# Altium schematic sheet 452006257#BDU控制板7-执行部件.SchDoc
size A3; SheetNumber: 12; SheetTotal: 11
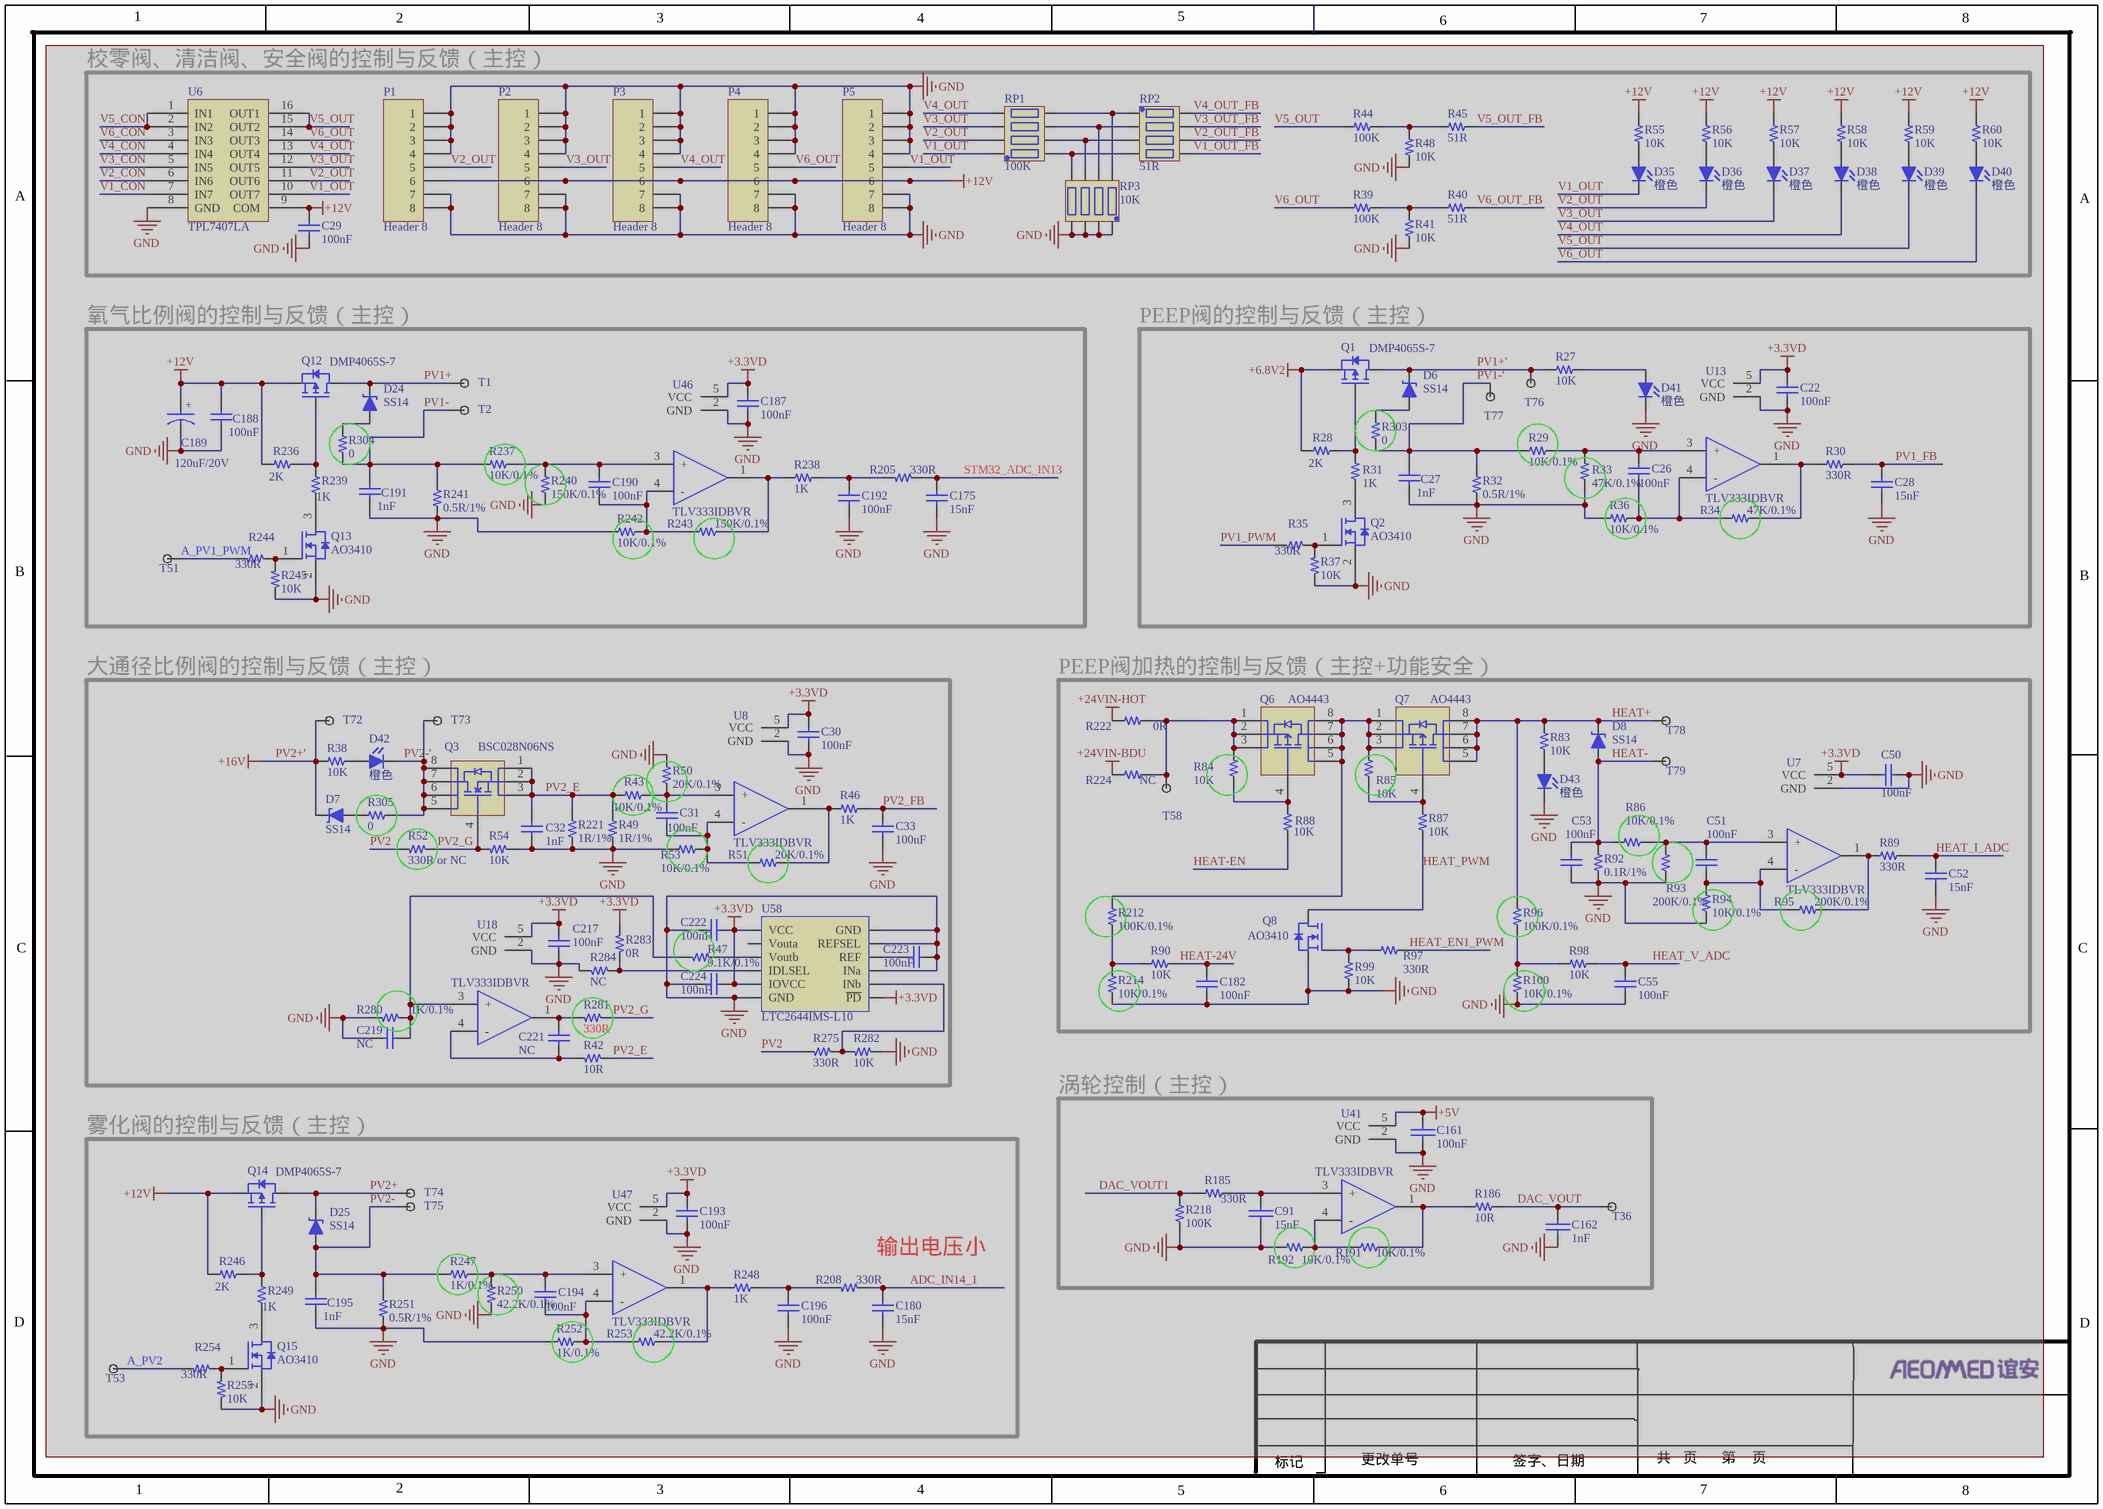
[diagram p0: 452006257#BDU控制板7-执行部件.SchDoc]

## Parts
C22  100nF  [C-0603]  (masked out: inside a compile mask, not in the netlist)
C26  100nF  [C-0603]  (masked out: inside a compile mask, not in the netlist)
C27  1nF  [C-0603]  (masked out: inside a compile mask, not in the netlist)
C28  15nF  [C-0603]  (masked out: inside a compile mask, not in the netlist)
C29  100nF  [C-0603]  (masked out: inside a compile mask, not in the netlist)
C30  100nF  [C-0603]  (masked out: inside a compile mask, not in the netlist)
C31  100nF  [C-0603]  (masked out: inside a compile mask, not in the netlist)
C32  1nF  [C-0603]  (masked out: inside a compile mask, not in the netlist)
C33  100nF  [C-0603]  (masked out: inside a compile mask, not in the netlist)
C50  100nF  [C-0603]  (masked out: inside a compile mask, not in the netlist)
C51  100nF  [C-0603]  (masked out: inside a compile mask, not in the netlist)
C52  15nF  [C-0603]  (masked out: inside a compile mask, not in the netlist)
C53  100nF  [C-0603]  (masked out: inside a compile mask, not in the netlist)
C55  100nF  [C-0603]  (masked out: inside a compile mask, not in the netlist)
C91  15nF  [C-0603]  (masked out: inside a compile mask, not in the netlist)
C161  100nF  [C-0603]  (masked out: inside a compile mask, not in the netlist)
C162  1nF  [C-0603]  (masked out: inside a compile mask, not in the netlist)
C175  15nF  [C-0603]  (masked out: inside a compile mask, not in the netlist)
C180  15nF  [C-0603]  (masked out: inside a compile mask, not in the netlist)
C182  100nF  [C-0603]  (masked out: inside a compile mask, not in the netlist)
C187  100nF  [C-0603]  (masked out: inside a compile mask, not in the netlist)
C188  100nF  [C-0603]  (masked out: inside a compile mask, not in the netlist)
C189  120uF/20V  [CAP-SMD-φ6.3]  (masked out: inside a compile mask, not in the netlist)
C190  100nF  [C-0603]  (masked out: inside a compile mask, not in the netlist)
C191  1nF  [C-0603]  (masked out: inside a compile mask, not in the netlist)
C192  100nF  [C-0603]  (masked out: inside a compile mask, not in the netlist)
C193  100nF  [C-0603]  (masked out: inside a compile mask, not in the netlist)
C194  100nF  [C-0603]  (masked out: inside a compile mask, not in the netlist)
C195  1nF  [C-0603]  (masked out: inside a compile mask, not in the netlist)
C196  100nF  [C-0603]  (masked out: inside a compile mask, not in the netlist)
C217  100nF  [C-0603]  (masked out: inside a compile mask, not in the netlist)
C219  NC  [C-0603]  (masked out: inside a compile mask, not in the netlist)
C221  NC  [C-0603]  (masked out: inside a compile mask, not in the netlist)
C222  100nF  [C-0603]  (masked out: inside a compile mask, not in the netlist)
C223  100nF  [C-0603]  (masked out: inside a compile mask, not in the netlist)
C224  100nF  [C-0603]  (masked out: inside a compile mask, not in the netlist)
D6  SS14  [DO-214AC/SMA]  (masked out: inside a compile mask, not in the netlist)
D7  SS14  [DO-214AC/SMA]  (masked out: inside a compile mask, not in the netlist)
D8  SS14  [DO-214AC/SMA]  (masked out: inside a compile mask, not in the netlist)
D24  SS14  [DO-214AC/SMA]  (masked out: inside a compile mask, not in the netlist)
D25  SS14  [DO-214AC/SMA]  (masked out: inside a compile mask, not in the netlist)
D35  橙色  [LED-0805]  (masked out: inside a compile mask, not in the netlist)
D36  橙色  [LED-0805]  (masked out: inside a compile mask, not in the netlist)
D37  橙色  [LED-0805]  (masked out: inside a compile mask, not in the netlist)
D38  橙色  [LED-0805]  (masked out: inside a compile mask, not in the netlist)
D39  橙色  [LED-0805]  (masked out: inside a compile mask, not in the netlist)
D40  橙色  [LED-0805]  (masked out: inside a compile mask, not in the netlist)
D41  橙色  [LED-0805]  (masked out: inside a compile mask, not in the netlist)
D42  橙色  [LED-0805]  (masked out: inside a compile mask, not in the netlist)
D43  橙色  [LED-0805]  (masked out: inside a compile mask, not in the netlist)
P1  Header 8  [K8X1C-705-K32-OX1]  (masked out: inside a compile mask, not in the netlist)
P2  Header 8  [K8X1C-705-K32-OX1]  (masked out: inside a compile mask, not in the netlist)
P3  Header 8  [K8X1C-705-K32-OX1]  (masked out: inside a compile mask, not in the netlist)
P4  Header 8  [K8X1C-705-K32-OX1]  (masked out: inside a compile mask, not in the netlist)
P5  Header 8  [K8X1C-705-K32-OX1]  (masked out: inside a compile mask, not in the netlist)
Q1  DMP4065S-7  [SOT23-3]  (masked out: inside a compile mask, not in the netlist)
Q2  AO3410  [SOT23-3]  (masked out: inside a compile mask, not in the netlist)
Q3  BSC028N06NS  [PG-TDSON-8]  (masked out: inside a compile mask, not in the netlist)
Q6  AO4443  [SOIC8]  (masked out: inside a compile mask, not in the netlist)
Q7  AO4443  [SOIC8]  (masked out: inside a compile mask, not in the netlist)
Q8  AO3410  [SOT23-3]  (masked out: inside a compile mask, not in the netlist)
Q12  DMP4065S-7  [SOT23-3]  (masked out: inside a compile mask, not in the netlist)
Q13  AO3410  [SOT23-3]  (masked out: inside a compile mask, not in the netlist)
Q14  DMP4065S-7  [SOT23-3]  (masked out: inside a compile mask, not in the netlist)
Q15  AO3410  [SOT23-3]  (masked out: inside a compile mask, not in the netlist)
R27  10K  [R-0603]  (masked out: inside a compile mask, not in the netlist)
R28  2K  [R-0603]  (masked out: inside a compile mask, not in the netlist)
R29  10K/0.1%  [R-0603]  (masked out: inside a compile mask, not in the netlist)
R30  330R  [R-0603]  (masked out: inside a compile mask, not in the netlist)
R31  1K  [R-0603]  (masked out: inside a compile mask, not in the netlist)
R32  0.5R/1%  [R-2010]  (masked out: inside a compile mask, not in the netlist)
R33  47K/0.1%  [R-0603]  (masked out: inside a compile mask, not in the netlist)
R34  47K/0.1%  [R-0603]  (masked out: inside a compile mask, not in the netlist)
R35  330R  [R-0603]  (masked out: inside a compile mask, not in the netlist)
R36  10K/0.1%  [R-0603]  (masked out: inside a compile mask, not in the netlist)
R37  10K  [R-0603]  (masked out: inside a compile mask, not in the netlist)
R38  10K  [R-0603]  (masked out: inside a compile mask, not in the netlist)
R39  100K  [R-0603]  (masked out: inside a compile mask, not in the netlist)
R40  51R  [R-0603]  (masked out: inside a compile mask, not in the netlist)
R41  10K  [R-0603]  (masked out: inside a compile mask, not in the netlist)
R42  10R  [R-0603]  (masked out: inside a compile mask, not in the netlist)
R43  10K/0.1%  [R-0603]  (masked out: inside a compile mask, not in the netlist)
R44  100K  [R-0603]  (masked out: inside a compile mask, not in the netlist)
R45  51R  [R-0603]  (masked out: inside a compile mask, not in the netlist)
R46  1K  [R-0603]  (masked out: inside a compile mask, not in the netlist)
R47  9.1K/0.1%  [R-0603]  (masked out: inside a compile mask, not in the netlist)
R48  10K  [R-0603]  (masked out: inside a compile mask, not in the netlist)
R49  1R/1%  [R-2010]  (masked out: inside a compile mask, not in the netlist)
R50  20K/0.1%  [R-0603]  (masked out: inside a compile mask, not in the netlist)
R51  20K/0.1%  [R-0603]  (masked out: inside a compile mask, not in the netlist)
R52  330R or NC  [R-0603]  (masked out: inside a compile mask, not in the netlist)
R53  10K/0.1%  [R-0603]  (masked out: inside a compile mask, not in the netlist)
R54  10K  [R-0603]  (masked out: inside a compile mask, not in the netlist)
R55  10K  [R-0603]  (masked out: inside a compile mask, not in the netlist)
R56  10K  [R-0603]  (masked out: inside a compile mask, not in the netlist)
R57  10K  [R-0603]  (masked out: inside a compile mask, not in the netlist)
R58  10K  [R-0603]  (masked out: inside a compile mask, not in the netlist)
R59  10K  [R-0603]  (masked out: inside a compile mask, not in the netlist)
R60  10K  [R-0603]  (masked out: inside a compile mask, not in the netlist)
R83  10K  [R-0603]  (masked out: inside a compile mask, not in the netlist)
R84  10K  [R-0603]  (masked out: inside a compile mask, not in the netlist)
R85  10K  [R-0603]  (masked out: inside a compile mask, not in the netlist)
R86  10K/0.1%  [R-0603]  (masked out: inside a compile mask, not in the netlist)
R87  10K  [R-0603]  (masked out: inside a compile mask, not in the netlist)
R88  10K  [R-0603]  (masked out: inside a compile mask, not in the netlist)
R89  330R  [R-0603]  (masked out: inside a compile mask, not in the netlist)
R90  10K  [R-0603]  (masked out: inside a compile mask, not in the netlist)
R92  0.1R/1%  [R-2010]  (masked out: inside a compile mask, not in the netlist)
R93  200K/0.1%  [R-0603]  (masked out: inside a compile mask, not in the netlist)
R94  10K/0.1%  [R-0603]  (masked out: inside a compile mask, not in the netlist)
R95  200K/0.1%  [R-0603]  (masked out: inside a compile mask, not in the netlist)
R96  100K/0.1%  [R-0603]  (masked out: inside a compile mask, not in the netlist)
R97  330R  [R-0603]  (masked out: inside a compile mask, not in the netlist)
R98  10K  [R-0603]  (masked out: inside a compile mask, not in the netlist)
R99  10K  [R-0603]  (masked out: inside a compile mask, not in the netlist)
R100  10K/0.1%  [R-0603]  (masked out: inside a compile mask, not in the netlist)
R185  330R  [R-0603]  (masked out: inside a compile mask, not in the netlist)
R186  10R  [R-0603]  (masked out: inside a compile mask, not in the netlist)
R191  10K/0.1%  [R-0603]  (masked out: inside a compile mask, not in the netlist)
R192  10K/0.1%  [R-0603]  (masked out: inside a compile mask, not in the netlist)
R205  330R  [R-0603]  (masked out: inside a compile mask, not in the netlist)
R208  330R  [R-0603]  (masked out: inside a compile mask, not in the netlist)
R212  100K/0.1%  [R-0603]  (masked out: inside a compile mask, not in the netlist)
R214  10K/0.1%  [R-0603]  (masked out: inside a compile mask, not in the netlist)
R218  100K  [R-0603]  (masked out: inside a compile mask, not in the netlist)
R221  1R/1%  [R-2010]  (masked out: inside a compile mask, not in the netlist)
R222  0R  [R-1206]  (masked out: inside a compile mask, not in the netlist)
R224  NC  [R-1206]  (masked out: inside a compile mask, not in the netlist)
R236  2K  [R-0603]  (masked out: inside a compile mask, not in the netlist)
R237  10K/0.1%  [R-0603]  (masked out: inside a compile mask, not in the netlist)
R238  1K  [R-0603]  (masked out: inside a compile mask, not in the netlist)
R239  1K  [R-0603]  (masked out: inside a compile mask, not in the netlist)
R240  150K/0.1%  [R-0603]  (masked out: inside a compile mask, not in the netlist)
R241  0.5R/1%  [R-2010]  (masked out: inside a compile mask, not in the netlist)
R242  10K/0.1%  [R-0603]  (masked out: inside a compile mask, not in the netlist)
R243  150K/0.1%  [R-0603]  (masked out: inside a compile mask, not in the netlist)
R244  330R  [R-0603]  (masked out: inside a compile mask, not in the netlist)
R245  10K  [R-0603]  (masked out: inside a compile mask, not in the netlist)
R246  2K  [R-0603]  (masked out: inside a compile mask, not in the netlist)
R247  1K/0.1%  [R-0603]  (masked out: inside a compile mask, not in the netlist)
R248  1K  [R-0603]  (masked out: inside a compile mask, not in the netlist)
R249  1K  [R-0603]  (masked out: inside a compile mask, not in the netlist)
R250  42.2K/0.1%  [R-0603]  (masked out: inside a compile mask, not in the netlist)
R251  0.5R/1%  [R-2010]  (masked out: inside a compile mask, not in the netlist)
R252  1K/0.1%  [R-0603]  (masked out: inside a compile mask, not in the netlist)
R253  42.2K/0.1%  [R-0603]  (masked out: inside a compile mask, not in the netlist)
R254  330R  [R-0603]  (masked out: inside a compile mask, not in the netlist)
R255  10K  [R-0603]  (masked out: inside a compile mask, not in the netlist)
R275  330R  [R-0603]  (masked out: inside a compile mask, not in the netlist)
R280  1K/0.1%  [R-0603]  (masked out: inside a compile mask, not in the netlist)
R281  330R  [R-0603]  (masked out: inside a compile mask, not in the netlist)
R282  10K  [R-0603]  (masked out: inside a compile mask, not in the netlist)
R283  0R  [R-0603]  (masked out: inside a compile mask, not in the netlist)
R284  NC  [R-0603]  (masked out: inside a compile mask, not in the netlist)
R303  0  [R-1206]  (masked out: inside a compile mask, not in the netlist)
R304  0  [R-1206]  (masked out: inside a compile mask, not in the netlist)
R305  0  [R-1206]  (masked out: inside a compile mask, not in the netlist)
RP1  100K  [RP-0603]  (masked out: inside a compile mask, not in the netlist)
RP2  51R  [RP-0603]  (masked out: inside a compile mask, not in the netlist)
RP3  10K  [RP-0603]  (masked out: inside a compile mask, not in the netlist)
T1  直插测试点  [测试点1]  (value not drawn)  (masked out: inside a compile mask, not in the netlist)
T2  直插测试点  [测试点1]  (value not drawn)  (masked out: inside a compile mask, not in the netlist)
T36  直插测试点  [DIPTP]  (value not drawn)  (masked out: inside a compile mask, not in the netlist)
T51  直插测试点  [DIPTP]  (value not drawn)  (masked out: inside a compile mask, not in the netlist)
T53  直插测试点  [DIPTP]  (value not drawn)  (masked out: inside a compile mask, not in the netlist)
T58  直插测试点  [DIPTP]  (value not drawn)  (masked out: inside a compile mask, not in the netlist)
T72  直插测试点  [测试点1]  (value not drawn)  (masked out: inside a compile mask, not in the netlist)
T73  直插测试点  [测试点1]  (value not drawn)  (masked out: inside a compile mask, not in the netlist)
T74  直插测试点  [测试点1]  (value not drawn)  (masked out: inside a compile mask, not in the netlist)
T75  直插测试点  [测试点1]  (value not drawn)  (masked out: inside a compile mask, not in the netlist)
T76  直插测试点  [测试点1]  (value not drawn)  (masked out: inside a compile mask, not in the netlist)
T77  直插测试点  [测试点1]  (value not drawn)  (masked out: inside a compile mask, not in the netlist)
T78  直插测试点  [测试点1]  (value not drawn)  (masked out: inside a compile mask, not in the netlist)
T79  直插测试点  [测试点1]  (value not drawn)  (masked out: inside a compile mask, not in the netlist)
U6  TPL7407LA  [SOIC16]  (masked out: inside a compile mask, not in the netlist)
U7  TLV333IDBVR  [SOT23-5]  (masked out: inside a compile mask, not in the netlist)
U8  TLV333IDBVR  [SOT23-5]  (masked out: inside a compile mask, not in the netlist)
U13  TLV333IDBVR  [SOT23-5]  (masked out: inside a compile mask, not in the netlist)
U18  TLV333IDBVR  [SOT23-5]  (masked out: inside a compile mask, not in the netlist)
U41  TLV333IDBVR  [SOT23-5]  (masked out: inside a compile mask, not in the netlist)
U46  TLV333IDBVR  [SOT23-5]  (masked out: inside a compile mask, not in the netlist)
U47  TLV333IDBVR  [SOT23-5]  (masked out: inside a compile mask, not in the netlist)
U58  LTC2644IMS-L10  [msop-12]  (masked out: inside a compile mask, not in the netlist)

## Blocks framed on the sheet
校零阀、清洁阀、安全阀的控制与反馈（主控）: C29 D35-D40 P1-P5 R39-R41 R44 R45 R48 R55-R60 RP1-RP3 U6
氧气比例阀的控制与反馈（主控）: C175 C187-C192 D24 Q12 Q13 R205 R236-R245 R304 T1 T2 T51 U46
PEEP阀的控制与反馈（主控）: C22 C26-C28 D6 D41 Q1 Q2 R27-R37 R303 T76 T77 U13
大通径比例阀的控制与反馈（主控）: C30-C33 C217 C219 C221-C224 D7 D42 Q3 R38 R42 R43 R46 R47 R49-R54 R221 R275 R280-R284 R305 T72 T73 U8 U18 U58
PEEP阀加热的控制与反馈（主控+功能安全）: C50-C53 C55 C182 D8 D43 Q6-Q8 R83-R90 R92-R100 R212 R214 R222 R224 T58 T78 T79 U7
涡轮控制（主控）: C91 C161 C162 R185 R186 R191 R192 R218 T36 U41

## Notes on the sheet
- 雾化阀的控制与反馈（主控）
- 输出电压小
- 1
- 2
- 3
- 4
- 5
- 6
- 7
- 8
- A
- B
- C
- D
- 更改单号
- 共   页      第    页
- 标记
- 签字、日期
- (in symbol CAP-RB8*3.5-0.6_Rubycon) +

## Library data of the parts
C22 C30 C50-C53 C55 C175 C180 C182 C187 C193 C217 C222-C224 = C-0603: 物料编号: *; 物料名称: *; 厂家: *; 详细描述: *
C26-C29 C31-C33 C188 C190-C192 C194-C196 C219 C221 = 100nF_1: 贴片瓷介电容100nF±5%,0805; 物料编号: 210001894; 详细描述: X7R,50V,三星CL21B104JBCNNNC; 版本: V1.00; 制造商: 三星; 名称: 贴片瓷介电容100nF±5%,0805
C91 C161 C162 = CAP: Capacitor
C189 = CAP-RB8*3.5-0.6_Rubycon
D6-D8 D24 D25 = Diode-稳压-213AB/LL34/MiniMELF: 厂家: *; 物料名称: *; 物料编号: *; 详细描述: *
D35-D43 = LED-0805
P1-P5 = Header 8: Header, 8-Pin; LatestRevisionDate: 17-Jul-2002; LatestRevisionNote: Re-released for DXP Platform.; Publisher: Altium Limited
Q1 Q12 Q14 = AO3415: 品牌：ALPHA&OMEGA，型号：AO3415，SOT-23，VDS=-20V，Id=-4A， ROHS
Q2 Q13 Q15 = AO3410: AOS,AO3410,SOT23-3,-55~+150°C,; 名称: N-MOS AO3410; 制造商: AOS; 详细信息: AOS,AO3410,SOT23-3,-55~+150°C,
Q3 = NMOS-PG-TDSON-8: 品牌：INFINEON，型号：BSC072N08NS5ATMA1,MOSFET, N通道, 80 V, 74 A, 0.0062 ohm, TDSON, 表面安装
Q6 Q7 = AO4443: AOS,AO4443,SOIC-8,-55~+150°C,ROHS; 名称: P-MOS AO4443; 制造商: AOS; 详细描述: AOS,AO4443,SOIC-8,-55~+150°C,ROHS
R27 R35 R37 R38 R42 R47 R52 R54-R60 R83-R90 R93-R96 R98 R100 R185 R186 R191 R192 R212 R214 R218 R244 R245 R254 R255 R275 R280-R284 = R-0603
R28 R31 R99 R222 R224 R236 R239 R246 R249 = 10K_1: 国巨RC0805FR-0710K; 版本: V1.00; 名称: 贴片电阻10K±1%; 物料编号: 210001830; 详细描述: 0805,1/8W,国巨RC0805FR-0710K; 制造商: 国巨
R29 R30 R33 R39-R41 R43-R46 R48 R50 R237 R238 R240 R247 R248 R250 R303-R305 = R 0603: 贴片电阻,0603; 制造商: 国巨
R32 R49 R221 R241 R251 = 1Ω_1: 国巨RC0805FR-071R; 版本: V1.00; 名称: 贴片电阻1±1%; 物料编号: 210001872; 详细描述: 0805,1/8W,国巨RC0805FR-071R; 制造商: 国巨
R34 R36 R51 R53 R242 R243 R252 R253 = 1K_1: 国巨RC0805FR-071K; 物料编号: 210001832; 详细描述: 0805,1/8W,国巨RC0805FR-071K; 制造商: 国巨; 版本: V1.00; 名称: 贴片电阻1K±1%
R92 = R-1210
R97 R205 R208 = 100Ω_1: 国巨RC0805FR-07100R; 物料编号: 210000765; 详细描述: 0805,1/8W,国巨RC0805FR-07100R; 制造商: 国巨; 版本: V1.00; 名称: 贴片电阻100±1%
RP1-RP3 = RP-0603
T1 T2 T36 T51 T53 T58 T72-T79 = Testpiont: 版本: V1.00; 名称: 直插测试点
U7 U8 U13 U18 U41 U46 U47 = TLV333IDBVR: 品牌：TI，型号：TLV333IDBVR,SOIC-8,–25°~+85°C,单运放，ROHS
U58 = LTC2644